# EAGLE schematic Spectra Mirror Bottom Board Final (EAGLE 6.5.0)
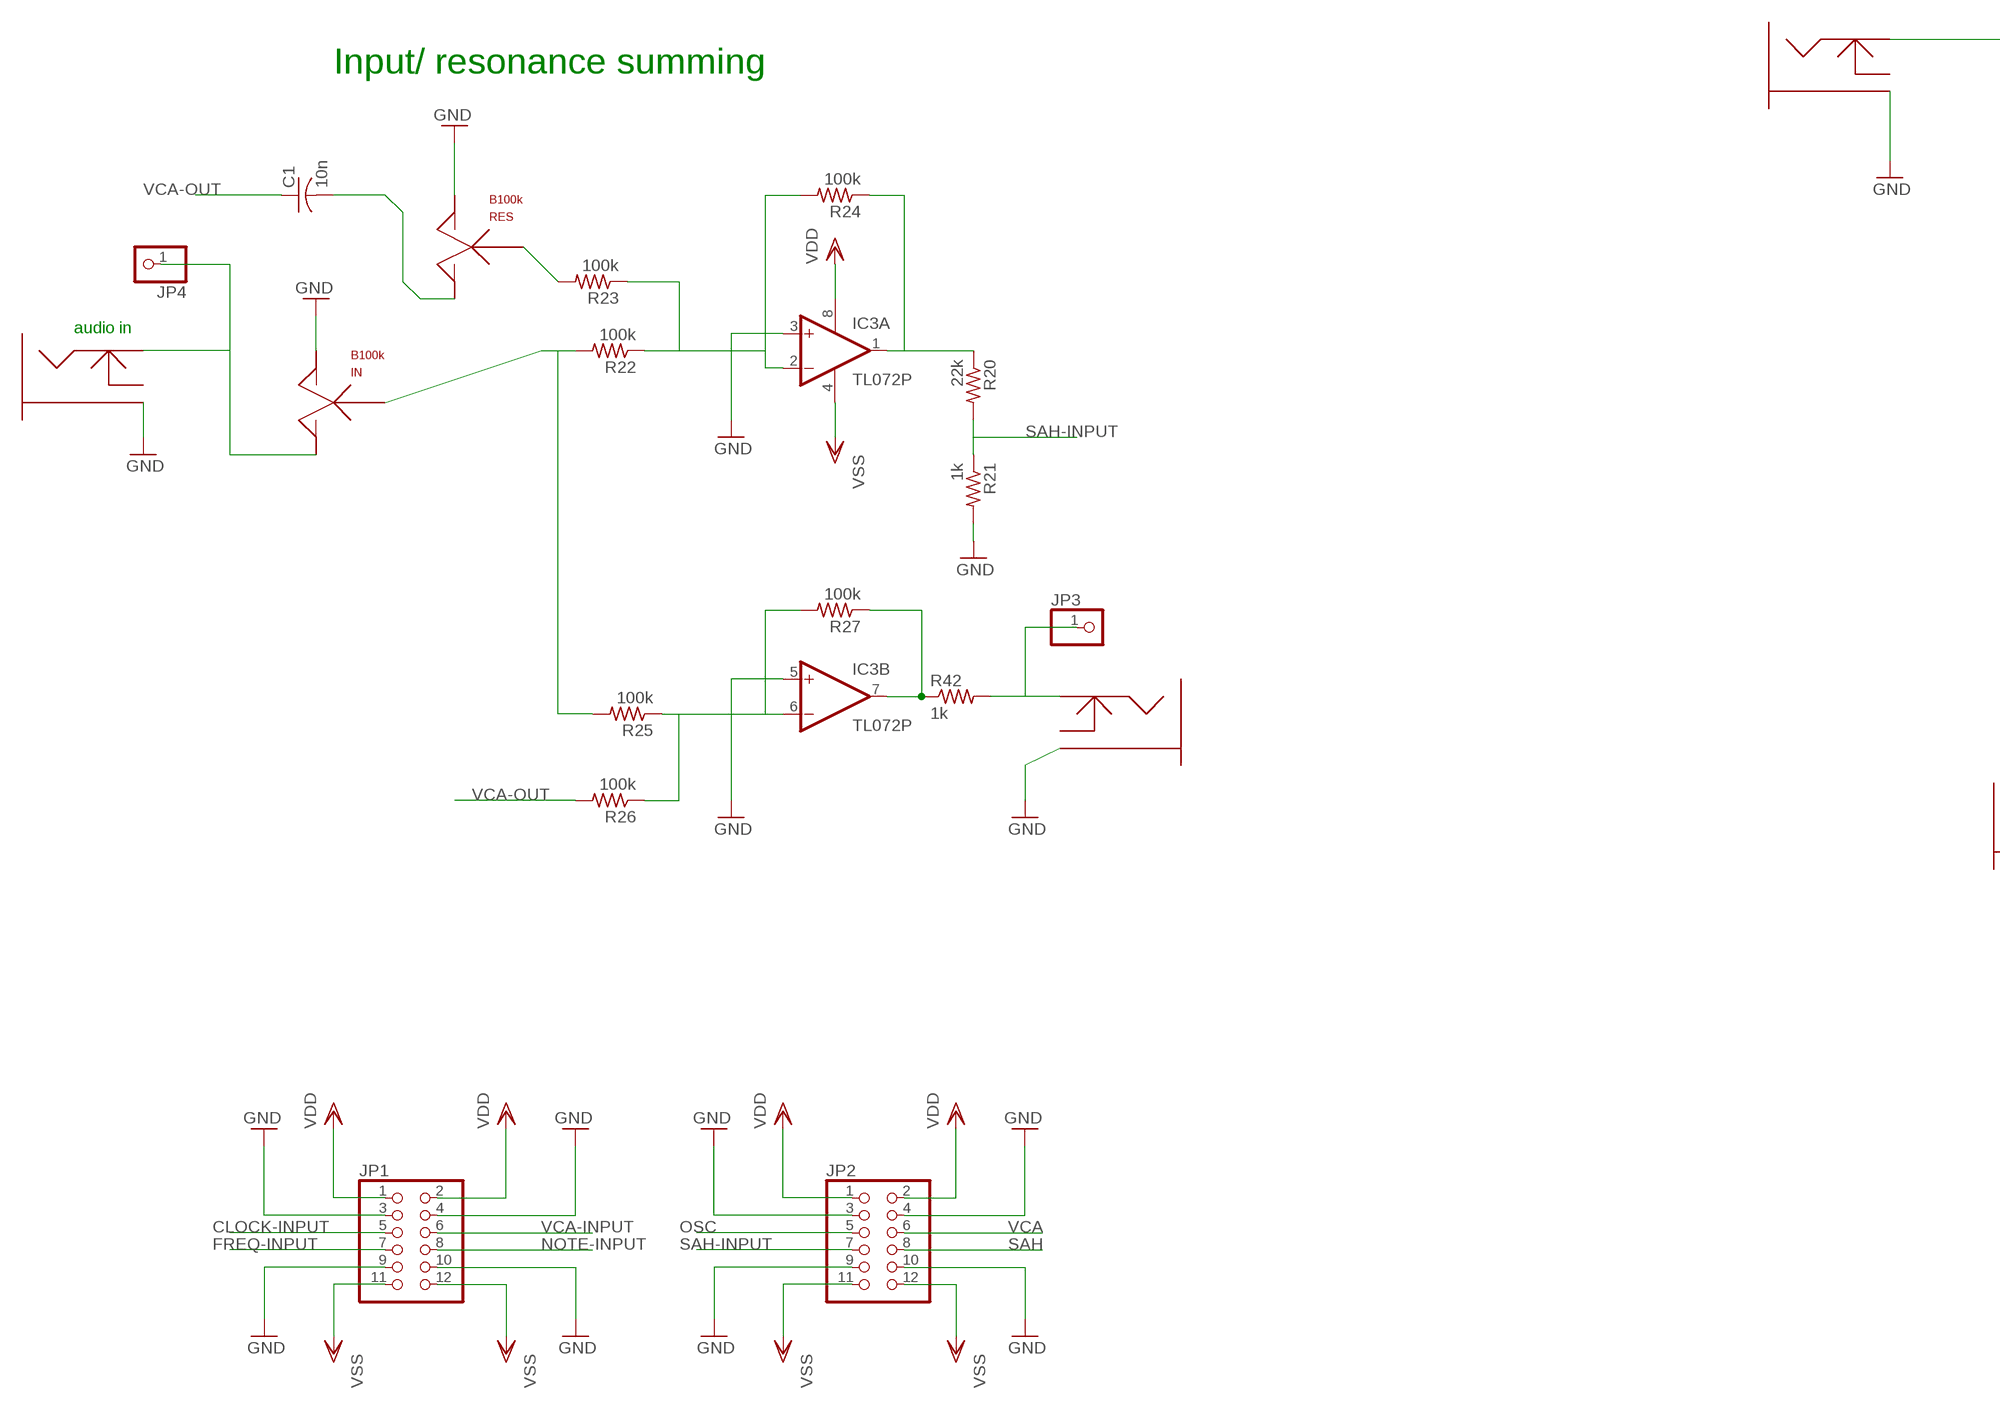
[diagram p0: schematic, sheet 1, part 1 of 2]
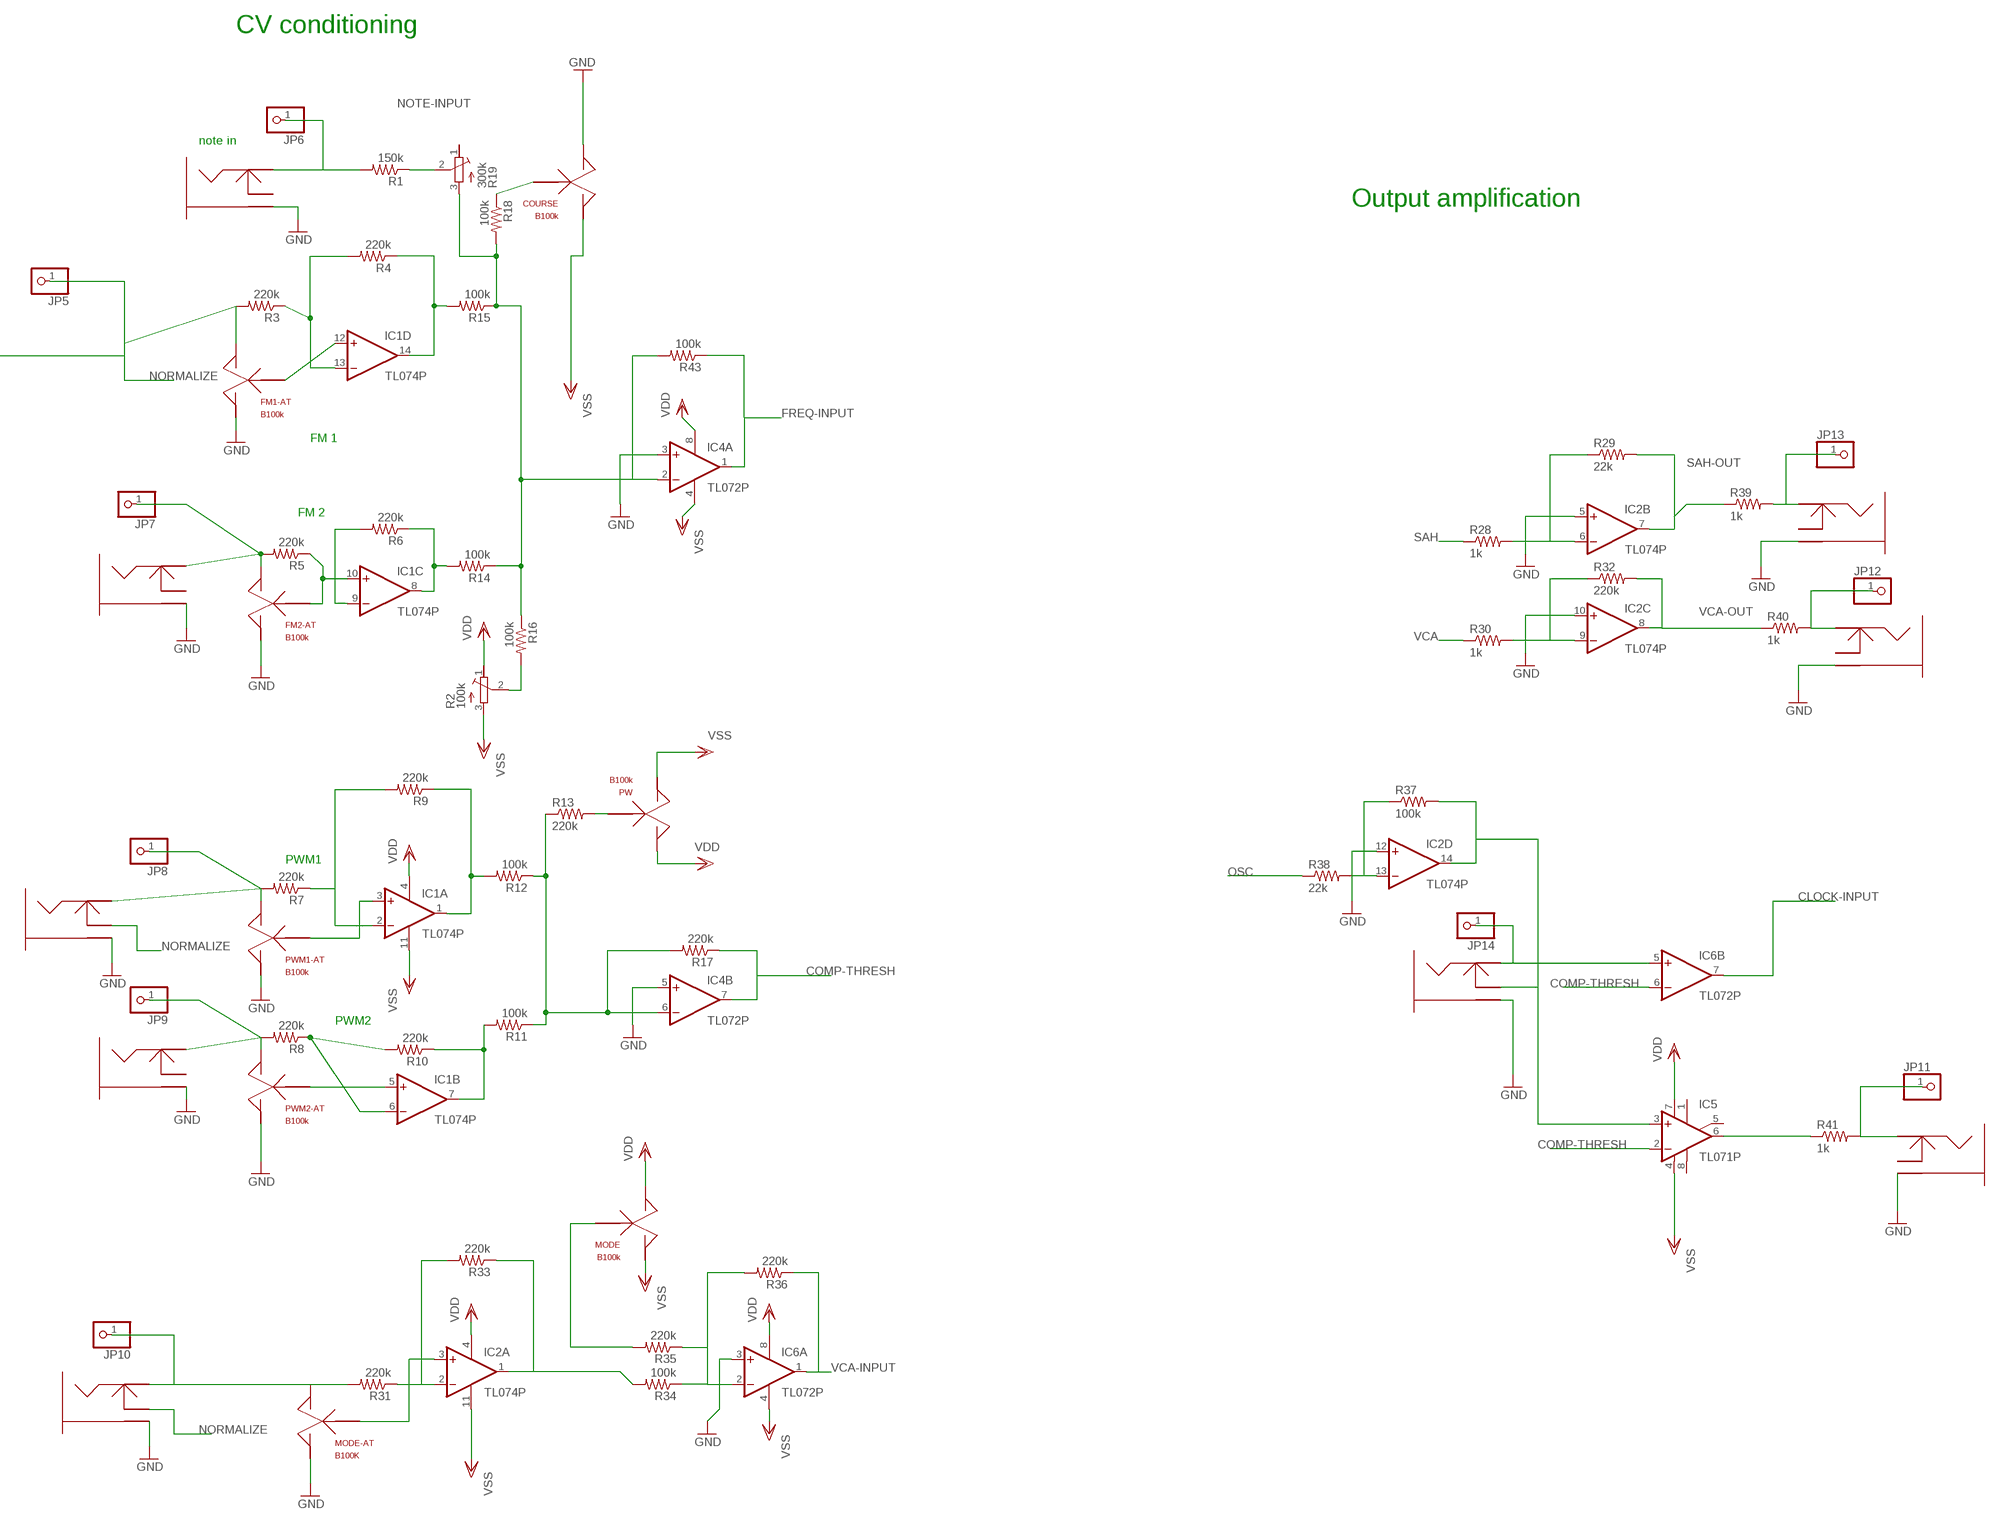
[diagram p1: schematic, sheet 1, part 2 of 2]

## Parts
C1  10n  C-US050-025X075  [C050-025X075]
COURSE  B100k  ALPHAPOT_BOARDMOUNT  [ALPHAPOT_BOARDMOUNT]
FM1-AT  B100k  ALPHAPOT_BOARDMOUNT  [ALPHAPOT_BOARDMOUNT]
FM2-AT  B100k  ALPHAPOT_BOARDMOUNT  [ALPHAPOT_BOARDMOUNT]
IC1  TL074P  [DIL14]
IC2  TL074P  [DIL14]
IC3  TL072P  [DIL08]
IC4  TL072P  [DIL08]
IC5  TL071P  [DIL08]
IC6  TL072P  [DIL08]
IN  B100k  ALPHAPOT_BOARDMOUNT  [ALPHAPOT_BOARDMOUNT]
JP1  PINHD-2X6  [2X06]
JP2  PINHD-2X6  [2X06]
JP3  PINHD-1X1  [1X01]
JP4  PINHD-1X1  [1X01]
JP5  PINHD-1X1  [1X01]
JP6  PINHD-1X1  [1X01]
JP7  PINHD-1X1  [1X01]
JP8  PINHD-1X1  [1X01]
JP9  PINHD-1X1  [1X01]
JP10  PINHD-1X1  [1X01]
JP11  PINHD-1X1  [1X01]
JP12  PINHD-1X1  [1X01]
JP13  PINHD-1X1  [1X01]
JP14  PINHD-1X1  [1X01]
MODE  B100k  ALPHAPOT_BOARDMOUNT  [ALPHAPOT_BOARDMOUNT]
MODE-AT  B100K  ALPHAPOT_BOARDMOUNT  [ALPHAPOT_BOARDMOUNT]
PW  B100k  ALPHAPOT_BOARDMOUNT  [ALPHAPOT_BOARDMOUNT]
PWM1-AT  B100k  ALPHAPOT_BOARDMOUNT  [ALPHAPOT_BOARDMOUNT]
PWM2-AT  B100k  ALPHAPOT_BOARDMOUNT  [ALPHAPOT_BOARDMOUNT]
R1  150k  R-US_0204/7  [0204/7]
R2  100k  R-TRIMMT93YA  [RTRIMT93YA]
R3  220k  R-US_0204/7  [0204/7]
R4  220k  R-US_0204/2V  [0204V]
R5  220k  R-US_0204/7  [0204/7]
R6  220k  R-US_0204/2V  [0204V]
R7  220k  R-US_0204/7  [0204/7]
R8  220k  R-US_0204/7  [0204/7]
R9  220k  R-US_0204/2V  [0204V]
R10  220k  R-US_0204/7  [0204/7]
R11  100k  R-US_0204/7  [0204/7]
R12  100k  R-US_0204/7  [0204/7]
R13  220k  R-US_0204/7  [0204/7]
R14  100k  R-US_0204/7  [0204/7]
R15  100k  R-US_0204/7  [0204/7]
R16  100k  R-US_0204/7  [0204/7]
R17  220k  R-US_0204/7  [0204/7]
R18  100k  R-US_0204/7  [0204/7]
R19  300k  R-TRIMMT93YA  [RTRIMT93YA]
R20  22k  R-US_0204/7  [0204/7]
R21  1k  R-US_0204/7  [0204/7]
R22  100k  R-US_0204/7  [0204/7]
R23  100k  R-US_0204/7  [0204/7]
R24  100k  R-US_0204/7  [0204/7]
R25  100k  R-US_0204/7  [0204/7]
R26  100k  R-US_0204/7  [0204/7]
R27  100k  R-US_0204/7  [0204/7]
R28  1k  R-US_0204/7  [0204/7]
R29  22k  R-US_0204/2V  [0204V]
R30  1k  R-US_0204/7  [0204/7]
R31  220k  R-US_0204/7  [0204/7]
R32  220k  R-US_0204/7  [0204/7]
R33  220k  R-US_0204/2V  [0204V]
R34  100k  R-US_0204/7  [0204/7]
R35  220k  R-US_0204/7  [0204/7]
R36  220k  R-US_0204/7  [0204/7]
R37  100k  R-US_0204/2V  [0204V]
R38  22k  R-US_0204/7  [0204/7]
R39  1k  R-US_0204/7  [0204/7]
R40  1k  R-US_0204/7  [0204/7]
R41  1k  R-US_0204/7  [0204/7]
R42  1k  R-US_0204/7  [0204/7]
R43  100k  R-US_0204/7  [0204/7]
RES  B100k  ALPHAPOT_BOARDMOUNT  [ALPHAPOT_BOARDMOUNT]
U$1  KOBICONPJ-301  [KOBICONPJ-301]
U$2  KOBICONPJ-301  [KOBICONPJ-301]
U$3  KOBICONPJ-301  [KOBICONPJ-301]
U$4  KOBICONPJ-301  [KOBICONPJ-301]
U$5  KOBICONPJ-301  [KOBICONPJ-301]
U$6  KOBICONPJ-301  [KOBICONPJ-301]
U$7  KOBICONPJ-301  [KOBICONPJ-301]
U$8  KOBICONPJ-301  [KOBICONPJ-301]
U$9  KOBICONPJ-301  [KOBICONPJ-301]
U$10  KOBICONPJ-301  [KOBICONPJ-301]
U$11  KOBICONPJ-301  [KOBICONPJ-301]
U$12  KOBICONPJ-301  [KOBICONPJ-301]

## Nets
CLOCK-INPUT: IC6.7(B:OUT) JP1.5
COMP-THRESH: IC4.7(B:OUT) IC5.2(-IN) IC6.6(B:-IN) R17.1
FREQ-INPUT: IC4.1(A:OUT) JP1.7 R43.1
GND: COURSE.LEFT FM1-AT.RIGHT FM2-AT.RIGHT IC2.5(B:+IN) IC2.10(C:+IN) IC2.12(D:+IN) IC3.3(A:+IN) IC3.5(B:+IN) IC4.3(A:+IN) IC4.5(B:+IN) IC6.3(A:+IN) IN.RIGHT JP1.3 JP1.4 JP1.9 JP1.10 JP2.3 JP2.4 JP2.9 JP2.10 MODE-AT.RIGHT PWM1-AT.RIGHT PWM2-AT.RIGHT R21.2 RES.RIGHT U$1.GND2(GROUND) U$1.GND(GROUND) U$2.GND2(GROUND) U$2.GND(GROUND) U$3.GND2(GROUND) U$3.GND(GROUND) U$4.GND2(GROUND) U$4.GND(GROUND) U$5.GND2(GROUND) U$5.GND(GROUND) U$6.GND2(GROUND) U$6.GND(GROUND) U$7.GND2(GROUND) U$7.GND(GROUND) U$8.GND2(GROUND) U$8.GND(GROUND) U$9.GND2(GROUND) U$9.GND(GROUND) U$10.GND2(GROUND) U$10.GND(GROUND) U$11.GND2(GROUND) U$11.GND(GROUND) U$12.GND2(GROUND) U$12.GND(GROUND)
KJDNFKDNF: IC1.13(D:-IN) R3.1 R4.2
N$1: R1.1 R19.2(S)
N$2: R2.2(S) R16.2
N$4: IC5.6(OUT) R41.1
N$5: IC1.14(D:OUT) R4.1 R15.2
N$6: FM1-AT.MID IC1.12(D:+IN)
N$7: FM2-AT.MID IC1.10(C:+IN) R5.1
N$8: IC1.9(C:-IN) R6.2
N$9: FM2-AT.LEFT JP7.1 R5.2 U$4.IN(INPUT)
N$10: IC1.8(C:OUT) R6.1 R14.2
N$11: JP9.1 PWM2-AT.LEFT R8.2 U$11.IN(INPUT)
N$12: IC1.6(B:-IN) R8.1 R10.2
N$13: JP8.1 PWM1-AT.LEFT R7.2 U$12.IN(INPUT)
N$14: IC1.2(A:-IN) R7.1 R9.2
N$15: IC1.1(A:OUT) R9.1 R12.2
N$16: IC1.3(A:+IN) PWM1-AT.MID
N$17: IC1.5(B:+IN) PWM2-AT.MID
N$18: IC1.7(B:OUT) R10.1 R11.2
N$19: IC4.6(B:-IN) R11.1 R12.1 R13.1 R17.2
N$20: PW.MID R13.2
N$21: IC4.2(A:-IN) R14.1 R15.1 R16.1 R18.2 R19.3(A) R43.2
N$22: COURSE.MID R18.1
N$24: JP10.1 MODE-AT.LEFT R31.2 U$10.IN(INPUT)
N$26: IN.LEFT JP4.1 U$1.IN(INPUT)
N$27: IN.MID R22.2 R25.2
N$28: IC3.6(B:-IN) R25.1 R26.1 R27.2
N$29: IC3.1(A:OUT) R20.1 R24.1
N$30: IC2.2(A:-IN) R31.1 R33.2
N$31: IC3.2(A:-IN) R22.1 R23.1 R24.2
N$32: IC3.7(B:OUT) R27.1 R42.1
N$33: R23.2 RES.MID
N$34: IC2.1(A:OUT) R33.1 R34.2
N$35: IC2.9(C:-IN) R30.2 R32.1
N$36: IC2.3(A:+IN) MODE-AT.MID
N$37: IC2.6(B:-IN) R28.2 R29.1
N$38: C1.2 RES.LEFT
N$39: IC6.2(A:-IN) R34.1 R35.1 R36.2
N$40: IC2.13(D:-IN) R37.1 R38.2
N$42: IC2.14(D:OUT) IC5.3(+IN) R37.2 U$9.SWITCH
N$43: MODE.MID R35.2
N$44: IC6.5(B:+IN) JP14.1 U$9.IN(INPUT)
N$45: JP11.1 R41.2 U$5.IN(INPUT)
N$46: JP12.1 R40.2 U$7.IN(INPUT)
N$47: JP13.1 R39.2 U$6.IN(INPUT)
N$48: JP3.1 R42.2 U$8.IN(INPUT)
NORMALIZE: FM1-AT.LEFT JP5.1 R3.2 U$3.IN(INPUT) U$10.SWITCH U$12.SWITCH
NOTE-INPUT: JP1.8 JP6.1 R1.2 U$2.IN(INPUT)
OSC: JP2.5 R38.1
SAH: JP2.8 R28.1
SAH-INPUT: JP2.7 R20.2 R21.1
SAH-OUT: IC2.7(B:OUT) R29.2 R39.1
VCA: JP2.6 R30.1
VCA-INPUT: IC6.1(A:OUT) JP1.6 R36.1
VCA-OUT: C1.1 IC2.8(C:OUT) R26.2 R32.2 R40.1
VDD: IC1.4(P:V+) IC2.4(P:V+) IC3.8(P:V+) IC4.8(P:V+) IC5.7(V+) IC6.8(P:V+) JP1.1 JP1.2 JP2.1 JP2.2 MODE.LEFT PW.LEFT R2.1(E)
VSS: COURSE.RIGHT IC1.11(P:V-) IC2.11(P:V-) IC3.4(P:V-) IC4.4(P:V-) IC5.4(V-) IC6.4(P:V-) JP1.11 JP1.12 JP2.11 JP2.12 MODE.RIGHT PW.RIGHT R2.3(A)
Unconnected: IC5.1(ON1) IC5.5(ON2) IC5.8(OPT) R19.1(E) U$1.SWITCH U$2.SWITCH U$3.SWITCH U$4.SWITCH U$5.SWITCH U$6.SWITCH U$7.SWITCH U$8.SWITCH U$11.SWITCH

## Notes on the sheet
- CV conditioning
- note in
- Output amplification
- Input/ resonance summing
- FM 1
- FM 2
- audio in
- PWM1
- PWM2

## Library data of the parts
C1 = rcl:C-US: CAPACITOR, American symbol
COURSE FM1-AT FM2-AT IN MODE MODE-AT PW PWM1-AT PWM2-AT RES = elipech_modified:ALPHAPOT_BOARDMOUNT
IC1 IC2 = linear:TL074: OP AMP
IC3 IC4 IC6 = linear:TL072: OP AMP
IC5 = linear:TL071: OP AMP
JP1 JP2 = pinhead:PINHD-2X6: PIN HEADER
JP3-JP14 = pinhead:PINHD-1X1: PIN HEADER
R1 R3-R18 R20-R43 = resistor:R-US_: RESISTOR, American symbol
R2 R19 = rcl:R-TRIMM: Trimm resistor
U$1-U$12 = elipech_modified:KOBICONPJ-301